# EAGLE design HV Board rev2 (EAGLE 9.0.1)
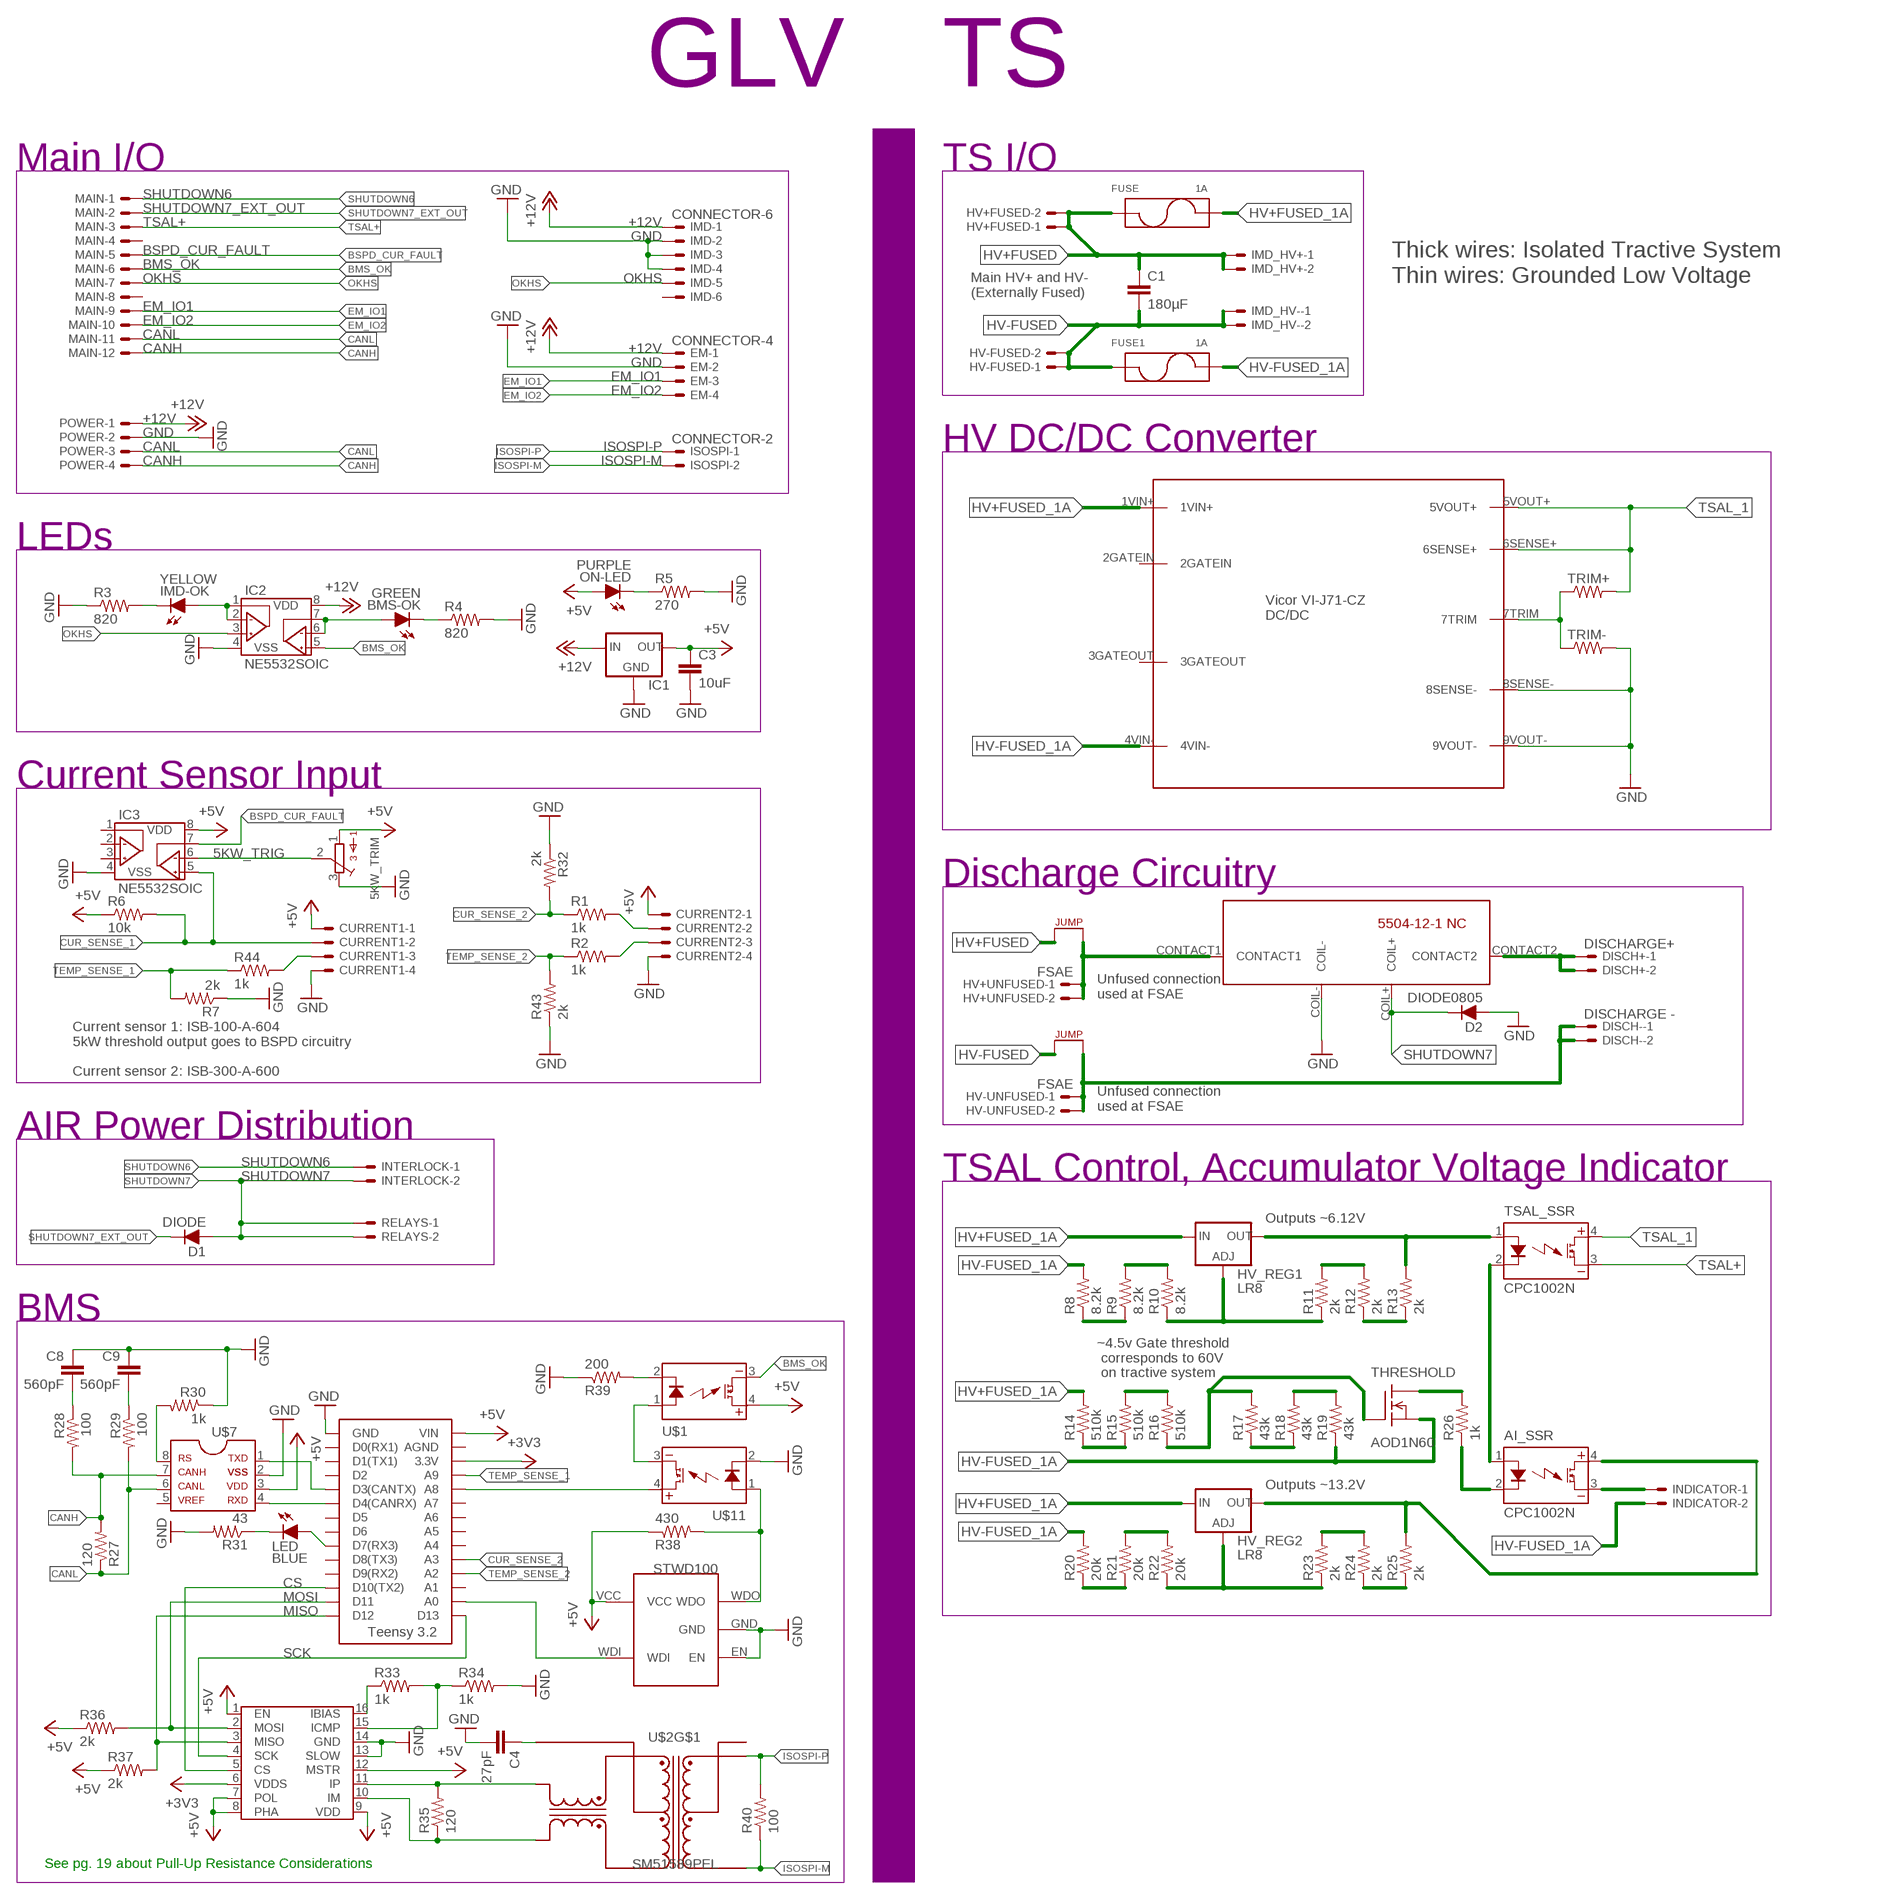
[diagram p0: schematic, sheet 1]

## Parts
5KW_TRIM  TRIMPOT_3296C  [TRIMPOT_3296]
AI_SSR  CPC1002N  [SOP04]
BMS-OK  GREEN  LED-0805  [LED-805]
C1  180µF  CAP  [LLS2V221MELZ]
C3  10uF  CAP0805  [0805]
C4  27pF  CAP0805  [0805]
C8  560pF  CAP0805  [0805]
C9  560pF  CAP0805  [0805]
CURRENT1  CONNECTOR-4  [MINIFIT_5566-4]
CURRENT2  CONNECTOR-4  [MINIFIT_5566-4]
D1  DIODE  DIODEDO-41  [DO-41]
D2  DIODE0805  [0805_D]
DISCH+  DISCHARGE+  MINIFIT_5566-2  [MINIFIT_5566-2]
DISCH-  DISCHARGE -  MINIFIT_5566-2  [MINIFIT_5566-2]
EM  CONNECTOR-4  CONNECTOR-4NANO-FIT-VERTICAL-4  [NANO-FIT_VERTICAL-4]
FUSE  1A  FUSE_5X20MM  [0751.0110]
FUSE1  1A  FUSE_5X20MM  [0751.0110]
HV+FUSED  MINIFIT_5566-2  [MINIFIT_5566-2]
HV+UNFUSED  FSAE  CONNECTOR-2  [MINIFIT_5566-2]
HV-FUSED  MINIFIT_5566-2  [MINIFIT_5566-2]
HV-UNFUSED  FSAE  CONNECTOR-2  [MINIFIT_5566-2]
HV_REG1  LR8  HV_LIN_REG_LR8SMD  [TO-252]
HV_REG2  LR8  HV_LIN_REG_LR8SMD  [TO-252]
IC1  5VREG_L7805_VERT  [TO-220]
IC2  NE5532SOIC  [SOIC-08]
IC3  NE5532SOIC  [SOIC-08]
IMD  CONNECTOR-6  CONNECTOR-6NANO-FIT_VERTICAL-6  [NANO-FIT_VERTICAL-6]
IMD-OK  YELLOW  LED-0805  [LED-805]
IMD_HV+  CONNECTOR-2  [MINIFIT_5566-2]
IMD_HV-  CONNECTOR-2  [MINIFIT_5566-2]
INDICATOR  MINIFIT_5566-2  [MINIFIT_5566-2]
INTERLOCK  MINIFIT_5566-2  [MINIFIT_5566-2]
ISOSPI  CONNECTOR-2  CONNECTOR-2NANO-FIT_VERTICAL-2  [NANO-FIT_VERTICAL-2]
LED  BLUE  LED-0805  [LED-805]
MAIN  CONNECTOR-12  [MINIFIT_5566-12]
ON-LED  PURPLE  LED-0805  [LED-805]
POWER  CONNECTOR-4  [MINIFIT_5566-4]
R1  1k  RESISTOR0805-RES  [0805]
R2  1k  RESISTOR0805-RES  [0805]
R3  820  RESISTOR0805-RES  [0805]
R4  820  RESISTOR0805-RES  [0805]
R5  270  RESISTOR0805-RES  [0805]
R6  10k  RESISTOR0805-RES  [0805]
R7  2k  RESISTOR0805-RES  [0805]
R8  8.2k  RESISTOR0805-RES  [0805]
R9  8.2k  RESISTOR0805-RES  [0805]
R10  8.2k  RESISTOR0805-RES  [0805]
R11  2k  RESISTOR0805-RES  [0805]
R12  2k  RESISTOR0805-RES  [0805]
R13  2k  RESISTOR0805-RES  [0805]
R14  510k  RESISTOR0805-RES  [0805]
R15  510k  RESISTOR0805-RES  [0805]
R16  510k  RESISTOR0805-RES  [0805]
R17  43k  RESISTOR0805-RES  [0805]
R18  43k  RESISTOR0805-RES  [0805]
R19  43k  RESISTOR0805-RES  [0805]
R20  20k  RESISTOR0805-RES  [0805]
R21  20k  RESISTOR0805-RES  [0805]
R22  20k  RESISTOR0805-RES  [0805]
R23  2k  RESISTOR0805-RES  [0805]
R24  2k  RESISTOR0805-RES  [0805]
R25  2k  RESISTOR0805-RES  [0805]
R26  1k  RESISTOR0805-RES  [0805]
R27  120  RESISTOR0805-RES  [0805]
R28  100  RESISTOR0805-RES  [0805]
R29  100  RESISTOR0805-RES  [0805]
R30  1k  RESISTOR0805-RES  [0805]
R31  43  RESISTOR0805-RES  [0805]
R32  2k  RESISTOR0805-RES  [0805]
R33  1k  RESISTOR0805-RES  [0805]
R34  1k  RESISTOR0805-RES  [0805]
R35  120  RESISTOR0805-RES  [0805]
R36  2k  RESISTOR0805-RES  [0805]
R37  2k  RESISTOR0805-RES  [0805]
R38  430  RESISTOR0805-RES  [0805]
R39  200  RESISTOR0805-RES  [0805]
R40  100  RESISTOR0805-RES  [0805]
R43  2k  RESISTOR0805-RES  [0805]
R44  1k  RESISTOR0805-RES  [0805]
RELAYS  MINIFIT_5566-2  [MINIFIT_5566-2]
THRESHOLD  AOD1N60  N-CHANNEL_MOSFETAOD1N60  [TO-252]
TRIM+  RESISTOR0805-RES  [0805]
TRIM-  RESISTOR0805-RES  [0805]
TSAL_SSR  CPC1002N  [SOP04]
U$1  CPC1002N  [SOP04]
U$2  SM51589PEL  [SM51589PEL]
U$3  JUMPER.3  [AXIAL-0.3]
U$4  JUMPER.3  [AXIAL-0.3]
U$5  HV_DCDC_VI-J71-CZ  [HV_DCDC_VI-J71-CZ]
U$7  MCP2551  [SOIC-08]
U$8  LTC6820  [MSOP-16]
U$9  TEENSY_3.2_SIMPLE  [TEENSY_3.2_SIMPLE]
U$10  STWD100  [SOT23-5]
U$11  CPC1002N  [SOP04]
U$12  5504-12-1-NC  [5504-12-1-NC]

## Nets
5KW_TRIG: 5KW_TRIM.2 IC3.6(VINB-)
+3V3: U$8.6(VDDS) U$9.3.3V
+5V: 5KW_TRIM.1 C3.1 CURRENT1.1 CURRENT2.1 IC1.3(OUT) IC3.8(VDD) ON-LED.A R6.1 R36.1 R37.1 R38.1 U$1.4(DC+) U$7.3 U$8.1(EN) U$8.7(POL) U$8.8(PHA) U$8.9(VDD) U$8.12(MSTR) U$9.VIN U$10.VCC
+12V: EM.P$1 IC1.1(IN) IC2.8(VDD) IMD.P$1 POWER.1
BMS_OK: IC2.5(VINB+) MAIN.6 U$1.3(DC-)
BMS_WATCH: U$1.1(CONTROL+) U$11.3(DC-)
BSPD_CUR_FAULT: IC3.7(VOUTB) MAIN.5
CANH: MAIN.12 POWER.4 R27.2 R28.2 U$7.7
CANL: MAIN.11 POWER.3 R27.1 R29.2 U$7.6
CS: U$8.5(CS) U$9.D10(TX2)
CUR_SENSE_1: CURRENT1.2 IC3.5(VINB+) R6.2
CUR_SENSE_2: R1.1 R32.2 U$9.A3
DISCHARGE1: HV+UNFUSED.1 HV+UNFUSED.2 U$3.P$2 U$12.CONTACT1
DISCHARGE2: DISCH+.1 DISCH+.2 U$12.CONTACT2
DISCHARGE3: DISCH-.1 DISCH-.2 HV-UNFUSED.1 HV-UNFUSED.2 U$4.P$2
EM_IO1: EM.P$3 MAIN.9
EM_IO2: EM.P$4 MAIN.10
GND: 5KW_TRIM.3 C3.2 C4.2 C8.1 C9.1 CURRENT1.4 CURRENT2.4 D2.A EM.P$2 IC1.2(GND) IC2.4(VSS) IC3.4(VSS) IMD.P$2 IMD.P$3 IMD.P$4 POWER.2 R3.1 R4.2 R5.2 R7.1 R30.1 R31.2 R32.1 R34.2 R39.1 R43.1 TRIM-.2 U$5.8SENSE- U$5.9VOUT- U$7.2 U$8.13(SLOW) U$8.14(GND) U$9.GND U$10.EN U$10.GND U$11.2(CONTROL-) U$12.COIL-
HV+FUSED: C1.P$1 FUSE.L1(P1) FUSE.L2(P1) HV+FUSED.1 HV+FUSED.2 IMD_HV+.1 IMD_HV+.2 U$3.P$1
HV+FUSED_1A: FUSE.R1(P2) FUSE.R2(P2) HV_REG1.1(IN) HV_REG2.1(IN) R14.2 U$5.1VIN+
HV-FUSED: C1.P$2 FUSE1.L1(P1) FUSE1.L2(P1) HV-FUSED.1 HV-FUSED.2 IMD_HV-.1 IMD_HV-.2 U$4.P$1
HV-FUSED_1A: FUSE1.R1(P2) FUSE1.R2(P2) INDICATOR.2 R8.2 R19.1 R20.2 THRESHOLD.3(S) U$5.4VIN-
ISOSPI-M: ISOSPI.P$2 R40.1 U$2.3(MX-)
ISOSPI-P: ISOSPI.P$1 R40.2 U$2.2(MX+)
MISO: R37.2 U$8.3(MISO) U$9.D12
MOSI: R36.2 U$8.2(MOSI) U$9.D11
N$1: AI_SSR.4(DC+) HV_REG2.2(TAB)(OUT) R25.2
N$2: HV_REG1.2(TAB)(OUT) R13.2 TSAL_SSR.1(CONTROL+)
N$3: ON-LED.C R5.1
N$4: R39.2 U$1.2(CONTROL-)
N$5: AI_SSR.2(CONTROL-) R26.1
N$6: AI_SSR.1(CONTROL+) TSAL_SSR.2(CONTROL-)
N$7: AI_SSR.3(DC-) INDICATOR.1
N$8: R8.1 R9.1
N$9: R26.2 THRESHOLD.2(TAB)(D)
N$10: R14.1 R15.1
N$11: R15.2 R16.2
N$12: R17.1 R18.1
N$13: R18.2 R19.2
N$14: R9.2 R10.2
N$15: HV_REG2.3(ADJ) R22.1 R23.1
N$16: R11.2 R12.2
N$17: R12.1 R13.1
N$18: HV_REG1.3(ADJ) R10.1 R11.1
N$19: R23.2 R24.2
N$20: R24.1 R25.1
N$21: R21.2 R22.2
N$22: R16.1 R17.2 THRESHOLD.1(G)
N$23: R20.1 R21.1
N$25: U$7.1 U$9.D3(CANTX)
N$26: R30.2 U$7.8
N$27: C8.2 R28.1
N$28: C9.2 R29.1
N$29: LED.C R31.1
N$30: CURRENT2.2 R1.2
N$31: R33.1 U$8.16(IBIAS)
N$32: R33.2 R34.1 U$8.15(ICMP)
N$33: R35.1 U$2.22(TD-) U$8.10(IM)
N$34: R35.2 U$2.23(TD+) U$8.11(IP)
N$35: C4.1 U$2.24(TCT)
N$36: U$7.4 U$9.D4(CANRX)
N$37: LED.A U$9.D7(RX3)
N$38: R38.2 U$10.WDO U$11.1(CONTROL+)
N$40: U$9.A8 U$11.4(DC+)
N$42: IC2.1(VOUTA) IC2.2(VINA-) IMD-OK.A
N$43: BMS-OK.A IC2.6(VINB-) IC2.7(VOUTB)
N$44: BMS-OK.C R4.1
N$45: IMD-OK.C R3.2
N$50: U$9.A0 U$10.WDI
N$53: CURRENT1.3 R44.2
N$54: CURRENT2.3 R2.2
OKHS: IC2.3(VINA+) IMD.P$5 MAIN.7
SCK: U$8.4(SCK) U$9.D13
SHUTDOWN6: INTERLOCK.1 MAIN.1
SHUTDOWN7: D1.A D2.C INTERLOCK.2 RELAYS.1 RELAYS.2 U$12.COIL+
SHUTDOWN7_EXT_OUT: D1.C MAIN.2
TEMP_SENSE_1: R7.2 R44.1 U$9.A9
TEMP_SENSE_2: R2.1 R43.2 U$9.A2
TRIM: TRIM+.1 TRIM-.1 U$5.7TRIM
TSAL+: MAIN.3 TSAL_SSR.3(DC-)
TSAL_1: TRIM+.2 TSAL_SSR.4(DC+) U$5.5VOUT+ U$5.6SENSE+
Unconnected: IC3.1(VOUTA) IC3.2(VINA-) IC3.3(VINA+) IMD.P$6 MAIN.4 MAIN.8 U$2.1(MCT) U$2.4(MCT) U$2.5(MX+) U$2.6(MX-) U$2.7(MCT) U$2.8(MX+) U$2.9(MX-) U$2.10(MCT) U$2.11(MX+) U$2.12(MX-) U$2.13(TD-) U$2.14(TD+) U$2.15(TCT) U$2.16(TD-) U$2.17(TD+) U$2.18(TCT) U$2.19(TD-) U$2.20(TD+) U$2.21(TCT) U$5.2GATEIN U$5.3GATEOUT U$7.5 U$9.A1 U$9.A4 U$9.A5 U$9.A6 U$9.A7 U$9.AGND U$9.D0(RX1) U$9.D1(TX1) U$9.D2 U$9.D5 U$9.D6 U$9.D8(TX3) U$9.D9(RX2)

## Notes on the sheet
- GLV
- TS
- Main I/O | TS I/O
- Thick wires: Isolated Tractive System
  Thin wires: Grounded Low Voltage
- Main HV+ and HV-
  (Externally Fused)
- HV DC/DC Converter
- LEDs
- Current Sensor Input
- Discharge Circuitry
- Unfused connection
  used at FSAE
- Current sensor 1: ISB-100-A-604
  5kW threshold output goes to BSPD circuitry
  
  Current sensor 2: ISB-300-A-600
- Unfused connection
  used at FSAE
- AIR Power Distribution
- TSAL Control, Accumulator Voltage Indicator
- Outputs ~6.12V
- BMS
- ~4.5v Gate threshold
   corresponds to 60V
   on tractive system
- Outputs ~13.2V
- See pg. 19 about Pull-Up Resistance Considerations

## Library data of the parts
5KW_TRIM = HyTechDevices:TRIMPOT_3296: 3296 Series 3/8" Square Trimmer Source <https://github.com/chiengineer/Eagle-Libraries/blob/master/Potentiometers/bourns.lbr>
AI_SSR TSAL_SSR U$1 U$11 = HyTechDevices:CPC1002N: IXYS Solid State Relay .7A
BMS-OK IMD-OK LED ON-LED = HyTechDevices:LED: Light Emitting Diode (LED) Source: Dangerous Prototypes Eagle Library <https://github.com/DangerousPrototypes/Eagle_Part_Library>
C1 C3 C4 C8 C9 = HyTechDevices:CAP: Capacitor Standard 0603 ceramic capacitor, and 0.1" leaded capacitor.
CURRENT1 CURRENT2 POWER = HyTechDevices:CONNECTOR-4: Mini-Fit Junior connector 4 pole Source: http://www.molex.com; OC_FARNELL: unknown; OC_NEWARK: unknown
D1 D2 = HyTechDevices:DIODE: DIODE general purpose rectifier
DISCH+ DISCH- HV+FUSED HV-FUSED INDICATOR INTERLOCK RELAYS = HyTechDevices:MINIFIT_5566-2: Mini-Fit Junior connector 2 pole Source: http://www.molex.com; OC_FARNELL: 1822072; OC_NEWARK: unknown
EM = HyTechDevices:CONNECTOR-4: Mini-Fit Junior connector 4 pole Source: http://www.molex.com
FUSE FUSE1 = HyTechDevices:FUSE: Fuse/Fuseclips Keystone Electronics 3568 Fuse Mouser Part <http://www.mouser.com/ProductDetail/Keystone-Electronics/3568> Datasheet <http://www.mouser.com/ds/2/215/568-742601.pdf> Bussman/Eaton Midget Fuse Clip 1A3400 <http://www.mouser.com/ProductDetail/Bussmann-Eaton/BK-1A3400-09-R/?qs=sGAEpiMZZMuG%252bgnN5hGYGzzlAelq2OxnKqVSMVjq8I4%3d> Schurter 0751.0110 Brass Fuse Clip Datasheet <http://www.mouser.com/ds/2/358/typ_OG__Clip__5x20-2553.pdf>
HV+UNFUSED HV-UNFUSED IMD_HV+ IMD_HV- = HyTechDevices:CONNECTOR-2: Mini-Fit Junior connector 2 pole Source: http://www.molex.com; OC_FARNELL: 1822072; OC_NEWARK: unknown
HV_REG1 HV_REG2 = HyTechDevices:HV_LIN_REG_LR8
IC1 = HyTechDevices:5VREG_L7805: Voltage Regulator Switching 5v regulator Datasheet <http://power.murata.com/data/power/oki-78sr.pdf> Standard 7805 5V regulator. IGO (Input Ground Output). Spark Fun Electronics SKU : COM-00107 Datasheet <http://www.mouser.com/ds/2/308/MC7800-D-94905.pdf>
IC2 IC3 = HyTechDevices:NE5532: TI NE5532 Dual Channel Op Amp
IMD = HyTechDevices:CONNECTOR-6: Mini-Fit Junior connector 6 pole Source: http://www.molex.com
ISOSPI = HyTechDevices:CONNECTOR-2: Mini-Fit Junior connector 2 pole Source: http://www.molex.com
MAIN = HyTechDevices:CONNECTOR-12: Mini-Fit Junior connector 12 pole Source: http://www.molex.com; OC_FARNELL: unknown; OC_NEWARK: unknown
R1-R40 R43 R44 TRIM+ TRIM- = HyTechDevices:RESISTOR: Resistor Basic schematic elements and footprints for 0603, 1206, and PTH resistors.
THRESHOLD = HyTechDevices:N-CHANNEL_MOSFET: Generic N-Channel MOSFET
U$2 = HyTechDevices:SM51589PEL: Bourns High Isolation LAN Transformer Module 5000 VAC Isolation Turns Ratio: 1CT:1CT Inductance: 350 uH Leakage Inductance: 0.5 uH Datasheet <http://www.mouser.com/ds/2/54/m51589pel-778121.pdf>
U$3 U$4 = HyTechDevices:JUMPER: Jumper for changing operation of a device
U$5 = HyTechDevices:HV_DCDC_VI-J71-CZ: Vicor-Corporation VI-J71-CZ Product Page <https://www.digikey.com/product-detail/en/vicor-corporation/VI-J71-CZ/1102-1486-ND/2996194> Datasheet <http://cdn.vicorpower.com/documents/datasheets/ds_vi-j00.pdf>
U$7 = HyTechDevices:MCP2551: MCP2551 High-Speed CAN Transceiver Product Webpage <https://www.microchip.com/wwwproducts/en/MCP2551> Datasheet <http://ww1.microchip.com/downloads/en/DeviceDoc/21667f.pdf> This device is outdated It is replaced by MCP2561. Comparison Page <https://www.microchip.com/wwwproducts/ProductCompare/MCP2551/MCP2561> Product Webpage <https://www.microchip.com/wwwproducts/en/MCP2561> Datasheet <http://ww1.microchip.com/downloads/en/DeviceDoc/20005167C.pdf>
U$8 = HyTechDevices:LTC6820
U$9 = HyTechDevices:TEENSY_3.2_SIMPLE: Simple version of the Teensy 3.2 board that only uses the 2 main rows of pins, not the inner pins or the pins opposite the usb port.
U$10 = HyTechDevices:STWD100: STWD100 Watchdog timer
U$12 = HyTechDevices:5504-12-1-NC: Relay 5504-12-1 Normally Closed(Form B)

## Board
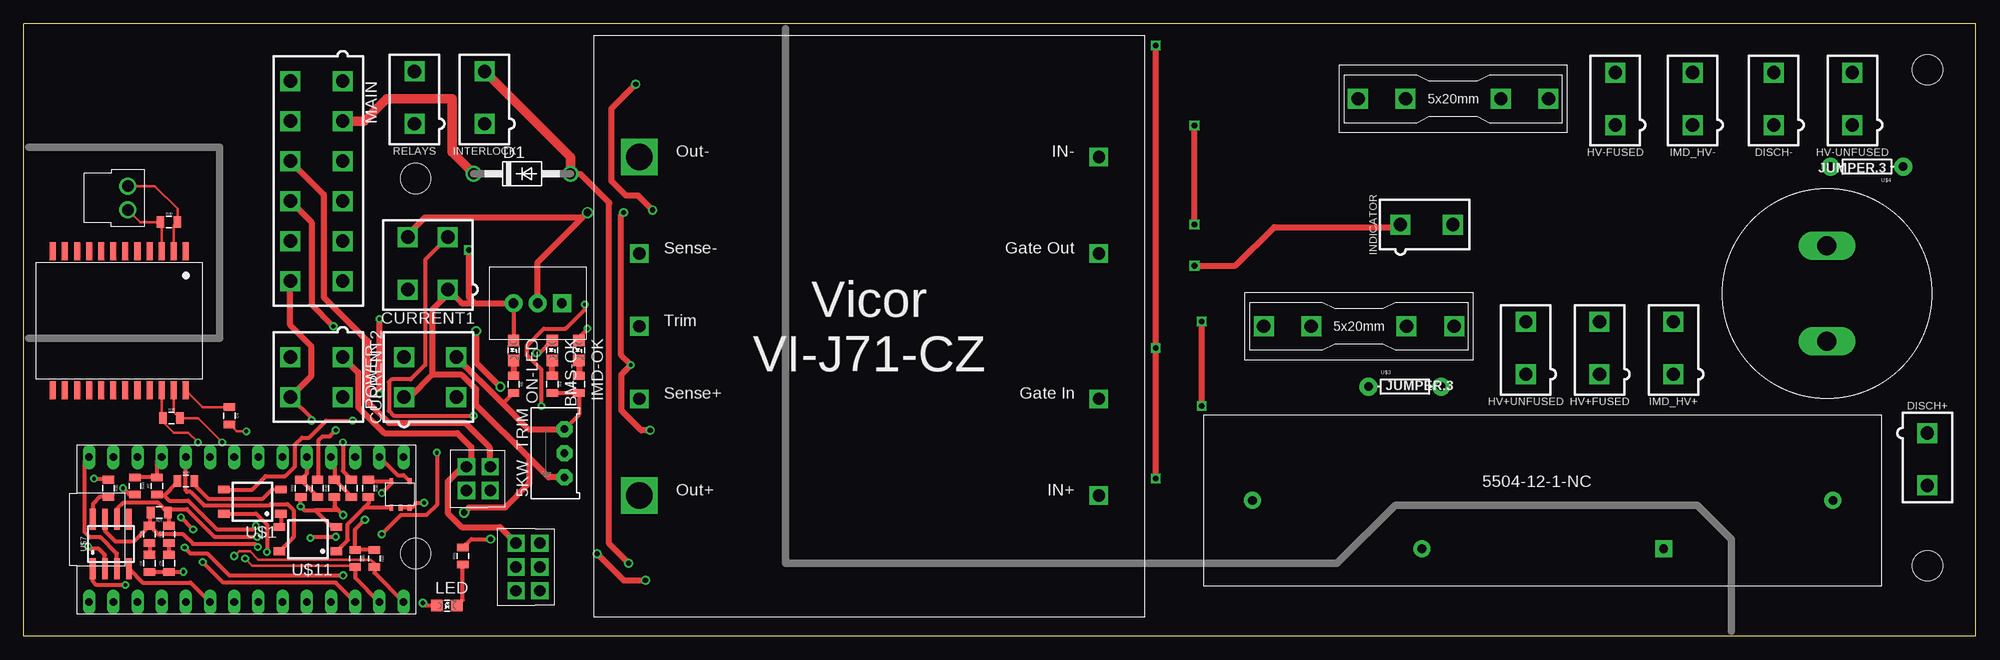
[diagram p1: board, top side]
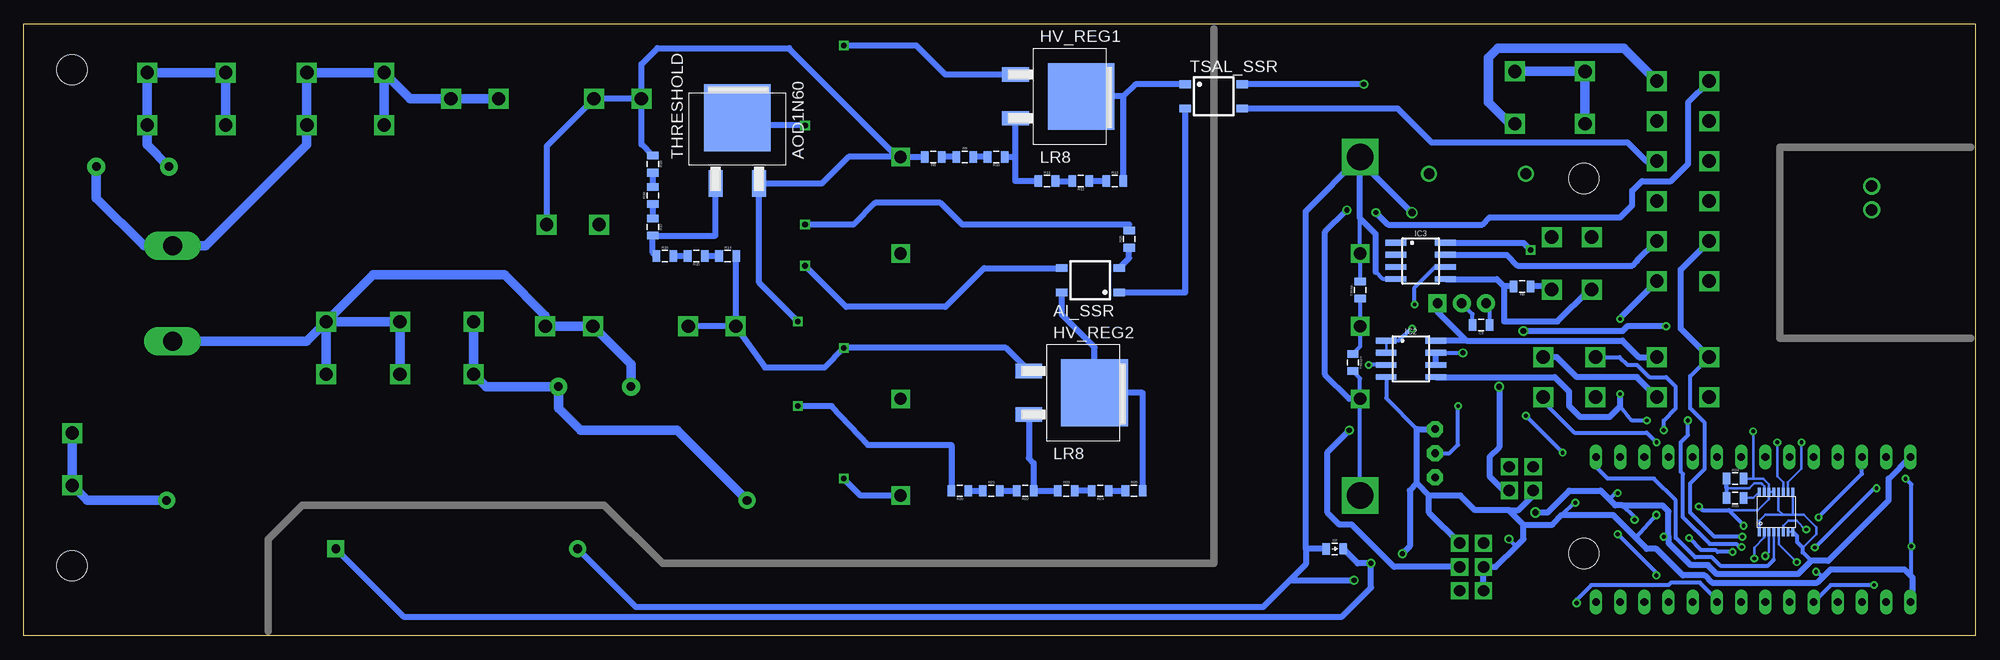
[diagram p2: board, bottom side, seen from below]

Size 204.98 x 64.26 mm. Coordinates in mm from the lower left corner, seen from the top.
Outline: 0,0 204.98,0 204.98,64.26 0,64.26 0,0
Copper layers (1*16): Top 0.035mm / dielectric 1.5mm / Bottom 0.035mm
Design rules "default *": minimum track width 6mil, minimum drill 15mil, track to track 6mil, track to pad 6mil, pad to pad 6mil, via to via 6mil, smd to smd 6mil, copper to edge 6mil, drill to drill 15mil, minimum pad ring 10mil, minimum via ring 8mil, stop-mask expansion 4mil, vias tented up to drill 0mil, thermal gap 10mil
Holes 3.2 mm at 41.15,48.01 41.15,8.64 199.9,7.37 199.9,59.44

### Footprints (pad centres in the part's own frame; a part is rotated, then mirrored left to right if it is on the bottom)
TRIMPOT_3296 = drill 0.813 pad 1.676 octagon: 1 2.54,1.27; 2 0,1.27; 3 -2.54,1.27
SOP04 = smd 0.8 x 1.2: 1 -1.27,-3; 2 1.27,-3; 3 1.27,3; 4 -1.27,3
LED-805 = smd 1.2 x 1.2: A 0,-1.05; C 0,1.05
LLS2V221MELZ = drill 2 long: P$1 -5,0; P$2 5,0
0805 = smd 0.8 x 1.2: 1 -0.9,0; 2 0.9,0
MINIFIT_5566-4 = drill 1.4 square: 1 2.1,-2.75; 2 -2.1,-2.75; 3 2.1,2.75; 4 -2.1,2.75
DO-41 = drill 1.118: A 5.08,0; C -5.08,0
0805_D = smd 0.8 x 1.2: A -0.9,0; C 0.9,0
MINIFIT_5566-2 = drill 1.4 square: 1 0,-2.75; 2 0,2.75
NANO-FIT_VERTICAL-4 = drill 1.2 square: P$1 -1.25,0; P$2 1.25,0; P$3 -1.25,2.5; P$4 1.25,2.5
0751.0110 = drill 1.4 square: L1 -10,0; L2 -5,0; R1 5,0; R2 10,0
TO-252 = smd 1.499 x 2.794: 1 -2.286,0; 3 2.286,0 | smd 7.01 x 7.01: 2(TAB) 0,6.909
TO-220 = drill 1 pad 1.88 square: 1 -2.54,0 | drill 1 pad 1.88: 2 0,0; 3 2.54,0
SOIC-08 = smd 0.6 x 2.2: 1 -1.905,-2.6; 2 -0.635,-2.6; 3 0.635,-2.6; 4 1.905,-2.6; 5 1.905,2.6; 6 0.635,2.6; 7 -0.635,2.6; 8 -1.905,2.6
NANO-FIT_VERTICAL-6 = drill 1.2 square: P$1 -2.5,0; P$2 0,0; P$3 2.5,0; P$4 -2.5,2.5; P$5 0,2.5; P$6 2.5,2.5
NANO-FIT_VERTICAL-2 = drill 1.2: P$1 -1.25,0; P$2 1.25,0
MINIFIT_5566-12 = drill 1.4 square: 1 10.5,-2.75; 2 6.3,-2.75; 3 2.1,-2.75; 4 -2.1,-2.75; 5 -6.3,-2.75; 6 -10.5,-2.75; 7 10.5,2.75; 8 6.3,2.75; 9 2.1,2.75; 10 -2.1,2.75; 11 -6.3,2.75; 12 -10.5,2.75
SM51589PEL = smd 0.635 x 1.905: 1 0,0; 2 1.27,0; 3 2.54,0; 4 3.81,0; 5 5.08,0; 6 6.35,0; 7 7.62,0; 8 8.89,0; 9 10.16,0; 10 11.43,0; 11 12.7,0; 12 13.97,0; 13 13.97,14.605; 14 12.7,14.605; 15 11.43,14.605; 16 10.16,14.605; 17 8.89,14.605; 18 7.62,14.605; 19 6.35,14.605; 20 5.08,14.605; 21 3.81,14.605; 22 2.54,14.605; 23 1.27,14.605; 24 0,14.605
AXIAL-0.3 = drill 0.9 pad 1.88: P$1 -3.81,0; P$2 3.81,0
HV_DCDC_VI-J71-CZ = drill 1.3 square: 1VIN+ 5.08,-12.7; 2GATEIN 5.08,-22.86; 3GATEOUT 5.08,-38.1; 4VIN- 5.08,-48.26; 6SENSE+ 53.34,-22.86; 7TRIM 53.34,-30.48; 8SENSE- 53.34,-38.1 | drill 2.8 square: 5VOUT+ 53.34,-12.7; 9VOUT- 53.34,-48.26
MSOP-16 = smd 0.305 x 0.889: 1 -0.1,-0.5; 2 0.4,-0.5; 3 0.9,-0.5; 4 1.4,-0.5; 5 1.9,-0.5; 6 2.4,-0.5; 7 2.9,-0.5; 8 3.4,-0.5; 9 3.4,3.7; 10 2.9,3.7; 11 2.4,3.7; 12 1.9,3.7; 13 1.4,3.7; 14 0.9,3.7; 15 0.4,3.7; 16 -0.1,3.7
TEENSY_3.2_SIMPLE = drill 0.8 long: 3.3V 16.51,29.21; A0 16.51,3.81; A1 16.51,6.35; A2 16.51,8.89; A3 16.51,11.43; A4 16.51,13.97; A5 16.51,16.51; A6 16.51,19.05; A7 16.51,21.59; A8 16.51,24.13; A9 16.51,26.67; AGND 16.51,31.75; D0(RX1) 1.27,31.75; D1(TX1) 1.27,29.21; D2 1.27,26.67; D3(CANTX) 1.27,24.13; D4(CANRX) 1.27,21.59; D5 1.27,19.05; D6 1.27,16.51; D7(RX3) 1.27,13.97; D8(TX3) 1.27,11.43; D9(RX2) 1.27,8.89; D10(TX2) 1.27,6.35; D11 1.27,3.81; D12 1.27,1.27; D13 16.51,1.27; GND 1.27,34.29; VIN 16.51,34.29
SOT23-5 = smd 0.61 x 0.406: EN -2.794,0; GND -2.794,0.94; VCC 0,1.905; WDI 0,0; WDO -2.794,1.905
5504-12-1-NC = drill 0.914 pad 1.778 square: COIL+ 48.26,-14.097 | drill 0.914 pad 1.778: COIL- 22.86,-14.097; CONTACT1 5.08,-9.017; CONTACT2 66.04,-9.017

### Placement (x,y rotation side)
5KW_TRIM  55.5,19.18 270 top
AI_SSR  92.96,37.34 90 bottom
BMS-OK  55.5,29.97 180 top
C1  189.36,35.94 90 top
C3  51.94,32.64 180 bottom
C4  21.59,23.11 270 top
C8  13.21,7.62 90 top
C9  15.24,7.62 90 top
CURRENT1  42.42,39.12 0 top
CURRENT2  42.67,27.18 270 top
D1  52.32,48.51 0 top
D2  67.31,9.14 0 bottom
DISCH+  199.9,18.54 180 top
DISCH-  183.77,56.39 0 top
EM  46.48,16.51 270 top
FUSE  140.21,32.51 180 top
FUSE1  150.11,56.39 180 top
HV+FUSED  165.48,30.23 0 top
HV+UNFUSED  157.73,30.23 0 top
HV-FUSED  167.13,56.39 0 top
HV-UNFUSED  192.02,56.39 0 top
HV_REG1  100.84,56.64 270 bottom
HV_REG2  99.44,25.53 270 bottom
IC1  53.98,34.92 180 top
IC2  59.31,29.08 270 bottom
IC3  58.29,39.37 270 bottom
IMD  51.69,7.24 270 top
IMD-OK  58.29,29.97 180 top
IMD_HV+  173.23,30.23 0 top
IMD_HV-  175.26,56.39 0 top
INDICATOR  147.32,43.18 270 top
INTERLOCK  48.39,56.52 0 top
ISOSPI  10.92,45.97 270 top
LED  44.45,3.17 270 top
MAIN  30.73,47.75 90 top
ON-LED  51.44,29.97 180 top
POWER  30.73,27.18 90 top
R1  30.86,15.49 90 top
R2  34.42,15.49 90 top
R3  58.29,26.42 90 top
R4  55.5,26.42 270 top
R5  51.44,26.42 270 top
R6  47.62,36.7 180 bottom
R7  13.97,15.75 90 top
R8  109.47,50.29 180 bottom
R9  106.17,50.29 0 bottom
R10  102.87,50.29 180 bottom
R11  97.54,47.75 0 bottom
R12  93.98,47.75 180 bottom
R13  90.42,47.75 0 bottom
R14  131.06,39.88 0 bottom
R15  134.37,39.88 180 bottom
R16  137.67,39.88 0 bottom
R17  138.94,42.93 270 bottom
R18  138.94,46.23 90 bottom
R19  138.94,49.53 270 bottom
R20  106.68,15.24 180 bottom
R21  103.38,15.24 0 bottom
R22  99.82,15.24 180 bottom
R23  95.5,15.24 0 bottom
R24  91.95,15.24 180 bottom
R25  88.39,15.24 0 bottom
R26  88.9,41.66 90 bottom
R27  14.22,12.95 180 top
R28  13.21,10.67 90 top
R29  15.24,10.67 90 top
R30  8.89,15.49 270 top
R31  46.1,8.38 90 top
R32  29.08,15.49 90 top
R33  25.27,14.48 180 bottom
R34  25.27,16.51 0 bottom
R35  15.49,22.86 0 top
R36  34.8,8.13 270 top
R37  36.83,8.13 270 top
R38  36.2,15.49 270 top
R39  17.02,16.26 0 top
R40  15.24,43.43 0 top
R43  32.64,15.49 90 top
R44  11.68,15.75 270 top
RELAYS  41.02,56.52 0 top
THRESHOLD  130.05,47.5 0 bottom
TRIM+  65.41,28.7 270 bottom
TRIM-  64.64,36.32 90 bottom
TSAL_SSR  80.01,56.64 270 bottom
U$1  24,14.1 90 top
U$2  17.02,40.39 180 top
U$3  145.03,26.16 0 top
U$4  193.55,49.28 180 top
U$5  117.98,2.03 180 top
U$7  9.14,9.65 0 top
U$8  22.61,11.43 0 bottom
U$9  41.15,2.29 90 top
U$10  40.51,16.26 90 top
U$11  29.84,10.16 90 top
U$12  123.95,23.24 0 top

### Tracks (layer width: path | path; a pad name or v marks a point on that pad's centre or on a via)
5KW_TRIG  (via drill 0.4)
  Top 0.406: v54.36,24.13 54.36,27.94 52.83,29.46 52.83,30.48 54.61,32.26 56.9,32.26 58.93,34.29 v58.93,34.8
  Bottom 0.406: 5KW_TRIM.2 55.24,19.18 54.36,20.07 v54.36,24.13 | IC3.6 56.75,38.73 58.93,36.55 v58.93,34.8
+3V3  (via drill 0.4)
  Top 0.406: v17.79,11.16 v16.51,12.45
  Bottom 0.254: U$8.6 20.21,11.54 19.68,12.06 18.8,12.06 17.9,11.16 v17.79,11.16
  Bottom 0.406: U$9.3.3V 11.94,17.02 v16.51,12.45
+5V  (via drill 0.4, 0.45, 0.6, 0.65)
  Top 0.406: IC1.3 ON-LED.A | R37.1 R36.1 34.8,11.18 v35.81,12.19 | R38.1 35.95,16.26 U$10.VCC 38.61,16 v37.59,14.99 | U$7.3 9.78,8.64 8.06,10.36 6.92,10.36 6.35,10.92 6.35,18.29 U$9.VIN | U$1.4 24.38,12.83 25.53,11.68 v25.53,8.81 | v30.1,10.29 30.23,10.41 v32.77,10.41
  Top 0.61: v46.74,40.51 46.74,35.56 47.37,34.92 | 47.37,34.92 IC1.3 | 42.9,27.41 42.93,27.43 42.93,34.29 44.52,35.88 CURRENT1.1 45.96,34.92 47.37,34.92 | 42.9,27.41 40.57,25.08 CURRENT2.1 | 42.9,27.41 46,27.41 47.52,25.88 47.52,24.24 53.09,18.68 | 53.09,18.68 53.09,16 50.55,13.46 46.76,13.46 v46.25,12.95 | 5KW_TRIM.1 55.13,16.64 53.09,18.68
  Bottom 0.254: U$8.1 22.71,12.09 22.1,12.7 20.19,12.7 | 20.19,12.7 19.25,12.7 | U$8.12 20.71,13.22 20.19,12.7 | U$8.9 19.21,12.74 19.25,12.7 | 19.25,12.7 18.03,12.7 16.76,11.43 16.76,10.67 18.16,9.27 | U$8.8 U$8.7
  Bottom 0.406: C3.1 51.04,34.53 IC1.3 | U$8.8 18.74,10.47 18.74,9.85 18.16,9.27 18.16,8.76 17.27,7.87 | v35.81,12.19 35.81,12.45 37.08,13.72 | v37.59,14.99 37.85,14.99 38.48,14.35 | v30.1,10.29 28.83,9.02 27.3,9.02 27.1,8.81 v25.53,8.81 | v32.77,10.41 32.26,10.41
  Bottom 0.61: IC3.8 47.5,41.27 v46.74,40.51 | CURRENT1.1 44.85,36.7 R6.1 | v46.25,12.95 44.96,12.95 42.67,15.24 39.37,15.24 38.48,14.35 37.85,13.72 37.08,13.72 32.89,13.72 32.26,13.08 32.26,10.41 32.26,9.78 29.91,7.43 28.13,7.43 27.18,6.48 18.67,6.48 17.27,7.87 15.49,7.87 9.14,14.22 9.14,16.51 U$9.VIN
+12V
  Top 0.61: POWER.1 35.13,27.63 35.13,24.02 37.86,21.29 45.52,21.29 46.99,19.81 46.99,18.27 EM.P$1 46.1,17.76 44.52,16.18 44.52,12.88 45.97,11.43 50,11.43 IMD.P$1
  Bottom 0.61: 53.48,30.99 IC2.8 | 53.48,30.99 37.08,30.99 35.37,29.28 POWER.1 | IC1.1 56.52,34.03 53.48,30.99
BMS_OK  (via drill 0.4)
  Top 0.406: v34.54,22.61 31.75,22.61 29.97,20.83 29.21,20.83 28.45,20.07 28.45,17.78 27.43,16.76 25.4,16.76 24,15.37 U$1.3
  Top 0.61: v37.34,33.27 v37.34,25.4
  Bottom 0.406: v34.54,22.61 36.09,22.61 37.34,24.11
  Bottom 0.61: IC2.5 44.2,27.18 42.67,25.65 42.67,24.13 41.52,22.98 38.47,22.98 37.34,24.11 v37.34,25.4 | MAIN.6 37.34,33.4 v37.34,33.27
BMS_WATCH
  Top 0.406: U$1.1 27,11.59 U$11.3
BSPD_CUR_FAULT
  Bottom 0.61: IC3.7 49.26,40.01 48.11,38.86 36.07,38.86 35.56,39.37 35.56,39.38 MAIN.5
CANH  (via drill 0.4, 0.45)
  Top 0.406: v30.23,22.61 30.23,22.84 POWER.4 | U$7.7 8.51,11.05 9.65,9.91 11.55,9.91 R28.2 | R27.2 13.21,12.84 R28.2 | R28.2 14.11,10.67 16.76,10.67 17.78,9.65 24.26,9.65 v24.57,9.34
  Top 0.61: POWER.4 30.23,27.32 30.23,30.35 27.98,32.59 MAIN.12
  Bottom 0.406: v30.23,22.61 30.23,21.08 30.99,20.32 30.99,17.27 30.73,17.02 30.73,12.45 27.94,9.65 25.15,9.65 24.83,9.34 v24.57,9.34
CANL  (via drill 0.4)
  Top 0.406: U$7.6 9.78,13.34 10.41,13.97 14.11,13.97 R27.1 | R27.1 15.24,12.84 R29.2 | R27.1 15.47,13.3 17.11,13.3 20,10.41 v24.51,10.41
  Bottom 0.406: 27.98,29.25 29.97,27.27 29.97,23.88 28.45,22.35 28.45,17.53 29.97,16 29.97,12.95 27.43,10.41 v24.51,10.41
  Bottom 0.61: POWER.3 27.98,29.25 30.99,32.26 30.99,38.45 MAIN.11
CS  (via drill 0.4)
  Top 0.406: U$9.D10(TX2) 32.77,5.59 20.95,5.59 v18.8,7.75
  Bottom 0.254: U$8.5 20.69,10.91 20.69,9.64 v18.8,7.75
CUR_SENSE_1
  Bottom 0.61: 49.53,36.7 49.53,33.02 43.92,33.02 40.57,36.37 CURRENT1.2 | IC3.5 50.29,37.47 49.53,36.7 | R6.2 49.53,36.7
CUR_SENSE_2
  Top 0.406: R1.1 29.08,16.37 R32.2 29.72,17.03 U$9.A3
DISCHARGE1
  Bottom 1.016: HV+UNFUSED.2 HV+UNFUSED.1 156.42,26.16 U$3.P$2 148.79,25.72 148.79,23.88 146.5,21.59 136.4,21.59 U$12.CONTACT1
DISCHARGE2
  Bottom 1.016: DISCH+.1 DISCH+.2 198.33,14.22 U$12.CONTACT2
DISCHARGE3
  Bottom 1.016: DISCH-.1 DISCH-.2 HV-UNFUSED.2 HV-UNFUSED.1 192.02,51.56 U$4.P$2
EM_IO1
  Top 0.61: MAIN.9 31.5,46.34 31.5,35.56 36.07,30.99 36.07,24.61 38.32,22.35 46.35,22.35 48.9,19.81 48.9,17.85 EM.P$3
EM_IO2  (via drill 0.45, 0.6)
  Top 0.61: MAIN.10 28.01,45.65 30.23,43.43 30.23,34.8 v32.51,32.51 | v47.5,32 47.5,28.7 v50.04,26.16
  Bottom 0.61: EM.P$4 49.55,15.26 51.05,16.76 51.05,18.8 50.04,19.81 v50.04,26.16 | v32.51,32.51 36.58,32.51 37.08,32 v47.5,32
GND  (via drill 0.4, 0.45, 0.5, 0.55, 0.75)
  Top 0.254: v23.37,21.47 22.33,21.47 C4.2
  Top 0.406: R4.2 R3.1 58.29,23.24 5KW_TRIM.3 | R5.2 50.47,24.55 50.15,24.55 | C8.1 C9.1 v16.75,6.72 v16.76,6.73 | U$10.GND U$10.EN 40.77,13.46 41.27,13.97 v42.04,13.97 | 30.61,13.21 29.46,13.21 v29.08,13.59 R32.1 | 32.46,11.62 U$11.2 32.38,11.43 30.61,13.21 | R31.2 46.98,10.16 v49.02,10.16 | 33.02,13.21 30.61,13.21 | 33.02,13.21 v33.53,12.7 | U$7.2 8.51,8.51 7.87,9.14 7.01,9.14 v6.75,9.4 | v7.37,16.51 9.03,16.51 R30.1 | R7.1 14.09,14.73 14.73,14.73 | 14.73,14.73 15.27,14.2 17.24,14.2 20.26,11.18 24,11.18 v24.38,11.56 | R39.1 16.12,16.12 14.73,14.73 | R43.1 32.64,13.59 33.02,13.21
  Top 0.61: IC1.2 53.98,39.24 58.67,43.94 | CURRENT2.4 50.15,24.55 52.98,21.72 5KW_TRIM.3 | v60.2,8.64 62.99,5.84 v65.28,5.84 | CURRENT1.4 40.32,42.12 42.14,43.94 58.67,43.94 | 58.67,43.94 v59.18,44.45
  Bottom 0.254: U$8.14 U$8.13 | U$8.14 21.71,14.36 22.86,13.21 25.91,13.21 | U$8.14 21.72,15.15 21.72,15.93 22.3,16.51 23.37,16.51 | 23.37,16.51 R34.2 | 23.37,16.51 v23.37,21.47
  Bottom 0.406: TRIM-.2 U$5.8SENSE- 64.64,43.83 | IC3.4 62.23,37.47 62.99,38.23 | IC2.4 61.91,24.95 58.67,21.72 | C3.2 52.84,33.79 IC1.2 | 6.66,6.15 6.75,6.25 v6.75,9.4 6.75,15.9 v7.37,16.51 | v49.02,10.16 48.39,9.53 48.13,9.53 | v33.53,12.7 35.69,10.29 | v24.38,11.56 24.38,11.68 25.91,13.21 28.7,13.21 v29.08,13.59 | v16.76,6.73 16.64,6.73 16.07,6.16 | v42.04,13.97 42.16,13.97 43.43,12.7
  Bottom 0.61: 5KW_TRIM.3 58.67,21.72 58.67,16 | 57.4,14.73 58.67,16 | U$5.9VOUT- 64.77,50.29 | U$5.9VOUT- 70.36,44.58 70.36,9.14 | 70.36,9.14 70.36,7.5 72.01,5.84 | D2.A 70.36,9.14 | U$5.9VOUT- 64.64,43.83 62.99,42.18 62.99,38.23 | 58.67,16 59.44,15.24 59.44,9.4 v60.2,8.64 | v59.18,44.45 64.64,49.91 U$5.9VOUT- | 57.4,14.73 54.1,14.73 52.58,13.21 49.02,13.21 | POWER.2 35.58,27.18 41.91,27.18 44.01,29.28 CURRENT2.4 | U$9.GND 6.66,3.76 6.66,6.15 7.49,6.99 15.24,6.99 16.07,6.16 16.64,5.59 27.69,5.59 28.45,6.35 30.73,6.35 33.53,9.14 34.54,9.14 35.69,10.29 38.1,12.7 43.43,12.7 44.45,11.68 47.5,11.68 | 72.01,5.84 v65.28,5.84 | IMD.P$3 IMD.P$2 50.42,7.24 48.13,9.53 47.5,10.16 47.5,11.68 | EM.P$2 46.48,14.73 48.01,13.21 49.02,13.21 | IMD.P$4 57.4,12.95 57.4,14.73 | 47.5,11.68 49.02,13.21 | U$12.COIL- 140.72,3.05 74.81,3.05 72.01,5.84
HV+FUSED
  Bottom 1.016: HV+FUSED.1 HV+FUSED.2 IMD_HV+.2 | IMD_HV+.1 IMD_HV+.2 | U$3.P$1 141.22,28.53 FUSE.L2 FUSE.L1 150.21,33.62 154.5,37.91 168.29,37.91 IMD_HV+.2 | C1.P$1 175.26,30.94 IMD_HV+.2
HV+FUSED_1A  (via drill 0.6)
  Top 0.61: v118.87,61.98 v118.87,30.23 v118.87,16.51
  Bottom 0.61: v118.87,61.98 111.25,61.98 108.2,58.93 HV_REG1.1 | HV_REG2.1 101.85,30.23 v118.87,30.23 120.9,28.19 127.16,28.19 FUSE.R2 | U$5.1VIN+ 117.09,14.73 v118.87,16.51 | FUSE.R2 FUSE.R1 | R14.2 130.21,39.83 FUSE.R2
HV-FUSED
  Bottom 1.016: HV-FUSED.2 HV-FUSED.1 | FUSE1.L2 FUSE1.L1 164.38,56.39 HV-FUSED.2 | HV-FUSED.2 IMD_HV-.2 IMD_HV-.1 175.26,51.56 185.88,40.94 C1.P$2 192.32,40.94 197.36,45.97 U$4.P$1
HV-FUSED_1A  (via drill 0.6)
  Top 0.61: v123.7,24.13 v123.7,33.02
  Bottom 0.61: 113.28,50.29 U$5.4VIN- R8.2 | 113.28,50.29 118.36,50.29 121.16,47.5 THRESHOLD.3 127.76,37.08 v123.7,33.02 | FUSE1.R2 FUSE1.R1 150.07,51.43 INDICATOR.2 | v123.7,24.13 120.14,24.13 116.33,20.07 107.58,20.07 R20.2 | 113.28,50.29 124.59,61.59 124.59,61.72 138.43,61.72 140.11,60.04 FUSE1.R2 | R19.1 140.11,51.61 FUSE1.R2
ISOSPI-M
  Top 0.254: U$2.3 14.48,43.31 14.37,43.42 R40.1 12.21,43.43 ISOSPI.P$2
ISOSPI-P
  Top 0.254: U$2.2 15.75,43.04 R40.2 16.14,44.82 13.74,47.22 ISOSPI.P$1
MISO  (via drill 0.45)
  Top 0.254: R37.2 36.83,7.62 36.45,8 24.64,8 23.75,8.89 22.61,8.89 v22.1,8.38
  Top 0.406: R37.2 36.83,6.6 U$9.D12
  Bottom 0.254: v22.1,8.38 21.71,8.77 U$8.3
MOSI  (via drill 0.4)
  Top 0.254: v23.24,8.13 24,7.37 34.66,7.37 R36.2
  Top 0.406: R36.2 34.8,6.1 U$9.D11
  Bottom 0.254: v23.24,8.13 23.24,9.27 22.23,10.29 22.23,10.35 22.22,10.35 22.22,10.91 U$8.2
N$1
  Bottom 0.61: R25.2 87.49,25.53 HV_REG2.2(TAB) 92.53,30.3 95.96,33.73 AI_SSR.4
N$2
  Bottom 0.61: 94.94,57.91 HV_REG1.2(TAB) 89.52,56.64 | 89.52,56.64 R13.2 | 89.52,56.64 88.25,57.91 TSAL_SSR.1
N$3
  Top 0.61: ON-LED.C R5.1
N$4
  Top 0.406: R39.2 17.92,15.86 19.43,14.35 25.02,14.35 26.04,15.37 U$1.2
N$5
  Bottom 0.61: R26.1 88.9,39.67 AI_SSR.2
N$6
  Bottom 0.61: AI_SSR.1 83.01,36.07 TSAL_SSR.2
N$7  (via drill 0.6)
  Top 0.61: v122.94,38.86 127.25,38.86 131.32,42.93 144.32,42.93 INDICATOR.1
  Bottom 0.61: AI_SSR.3 104.14,38.61 108.2,34.54 118.62,34.54 v122.94,38.86
N$8
  Bottom 0.61: R9.1 R8.1
N$9  (via drill 0.6)
  Top 0.61: v122.94,43.18 v122.94,53.59
  Bottom 0.61: R26.2 88.9,43.18 106.43,43.18 108.71,45.47 115.57,45.47 117.86,43.18 v122.94,43.18 | v122.94,53.59 129.24,53.59 THRESHOLD.2(TAB)
N$10
  Bottom 0.61: R14.1 R15.1
N$11
  Bottom 0.61: R15.2 R16.2
N$12
  Bottom 0.61: R18.1 R17.1
N$13
  Bottom 0.61: R19.2 R18.2
N$14
  Bottom 0.61: R10.2 R9.2
N$15
  Bottom 0.61: R23.1 R22.1 98.92,18.15 99.44,18.67 HV_REG2.3 99.31,23.24
N$16
  Bottom 0.61: R11.2 R12.2
N$17
  Bottom 0.61: R13.1 R12.1
N$18
  Bottom 0.61: 100.84,50.29 HV_REG1.3 | R10.1 100.84,50.29 | 100.84,50.29 100.84,47.75 R11.1
N$19
  Bottom 0.61: R24.2 R23.2
N$20
  Bottom 0.61: R24.1 R25.1
N$21
  Bottom 0.61: R21.2 R22.2
N$22
  Bottom 0.61: THRESHOLD.1 132.33,42.03 R17.2 138.94,40.25 R16.1
N$23
  Bottom 0.61: R20.1 R21.1
N$25  (via drill 0.4)
  Top 0.406: U$7.1 7.24,5.71 7.62,5.33 v10.67,5.33
  Bottom 0.406: v10.67,5.33 15.24,5.33 U$9.D3(CANTX)
N$26
  Top 0.406: R30.2 7.99,14.59 7.24,13.84 U$7.8
N$27
  Top 0.406: R28.1 C8.2
N$28
  Top 0.406: R29.1 C9.2
N$29
  Top 0.406: LED.C 46.1,3.78 R31.1
N$30  (via drill 0.45)
  Top 0.406: v32.77,21.59 32.13,20.95 31.37,20.95 30.99,20.57 30.99,16.52 R1.2
  Bottom 0.406: CURRENT2.2 37.41,29.28 36.58,28.45 35.56,28.45 34.29,27.18 32.51,27.18 31.5,26.16 31.5,23.88 32.77,22.61 v32.77,21.59
N$31
  Bottom 0.254: R33.1 23.36,14.48 U$8.16
N$32
  Bottom 0.254: 26.17,15.49 23.75,15.49 23.24,16 22.51,16 22.42,15.9 22.22,15.71 22.22,15.15 U$8.15
  Bottom 0.406: R33.2 R34.1 26.17,15.49
N$33  (via drill 0.4)
  Top 0.254: v18.29,20.32 17.27,21.34 15.75,21.34 14.6,22.49 14.6,22.88 R35.1 14.48,22.98 U$2.22
  Bottom 0.254: v18.29,20.32 18.29,17.53 19.71,16.11 U$8.10
N$34  (via drill 0.4)
  Top 0.254: v20.83,20.32 18.29,22.86 R35.2 15.75,23.51 U$2.23
  Bottom 0.254: U$8.11 20.21,16.14 20.83,16.76 v20.83,20.32
N$35
  Top 0.254: U$2.24 18.79,24.01 C4.1
N$36
  Top 0.406: U$9.D4(CANRX) 17.53,5.59 12.51,5.59 U$7.4
N$37  (via drill 0.5)
  Top 0.406: LED.A 42.2,3.17 v41.91,3.46
  Bottom 0.406: U$9.D7(RX3) 27.18,3.81 28.96,5.59 32,5.59 32.26,5.33 40.39,5.33 41.91,3.81 v41.91,3.46
N$38
  Top 0.406: 35.74,13.46 34.01,11.74 34.01,10.06 U$11.1 | U$10.WDO 35.74,13.46 | R38.2 36.2,13.92 35.74,13.46
N$40
  Top 0.406: U$9.A8 17.02,15.24 17.14,15.11 17.53,15.11 18.92,13.72 25.78,13.72 25.91,13.84 27.69,13.84 28.32,13.21 28.32,10.37 U$11.4
N$42  (via drill 0.4)
  Top 0.406: IMD-OK.A 58.29,31.37 v59.18,32.26
  Bottom 0.254: IC2.2 IC2.1
  Bottom 0.406: IC2.1 60.6,30.99 59.33,32.26 v59.18,32.26
N$43  (via drill 0.5)
  Top 0.406: v53.85,29.72 54.2,29.72 BMS-OK.A
  Bottom 0.406: IC2.7 v53.85,29.72
  Bottom 0.61: IC2.6 IC2.7
N$44
  Top 0.61: R4.1 BMS-OK.C
N$45
  Top 0.61: IMD-OK.C R3.2
N$50
  Top 0.406: U$9.A0 39.24,16.89 39.88,16.89 U$10.WDI
N$53  (via drill 0.4, 0.45)
  Top 0.406: v33.53,6.35 21.59,6.35 19.3,8.64 17.53,8.64 v16.89,9.27 | CURRENT1.3 42.16,39.51 42.16,28.45 40.64,26.92 38.61,26.92 38.35,26.67 38.35,23.62 38.86,23.11 v47.24,23.11 | v37.59,10.67 39.62,12.7 42.29,12.7 43.43,13.84 43.43,19.18 v43.37,19.24 | v10.41,15.49 11.06,14.85 R44.2
  Bottom 0.406: v47.24,23.11 v43.37,19.24 | v33.53,6.35 33.53,6.6 v37.59,10.67 | v10.41,15.49 10.67,15.49 v16.89,9.27
N$54  (via drill 0.4)
  Top 0.406: R2.2 33.52,17.29 v33.52,20.32
  Bottom 0.406: CURRENT2.3 45.42,24.59 42.16,21.34 34.54,21.34 v33.53,20.32 v33.52,20.32
OKHS  (via drill 0.4, 0.5, 0.55)
  Top 0.406: 63.78,28.47 v63.75,28.45
  Top 0.61: v65.79,21.59 64.83,21.59 62.77,23.65 62.77,27.46 63.78,28.47 | v63.75,28.45 62.74,29.46 62.74,44.2 v62.99,44.45
  Bottom 0.406: IC2.3 v63.75,28.45
  Bottom 0.61: v62.99,44.45 61.72,43.18 51.82,43.18 51.05,43.94 37.34,43.94 36.07,45.21 36.07,46.74 35.05,47.75 32,47.75 30.23,49.53 30.23,56.01 MAIN.7 | v65.79,21.59 68.07,19.3 68.07,12.95 66.8,11.68 65.53,11.68 61.09,7.24 IMD.P$5
SCK
  Bottom 0.254: U$8.4 21.21,8
  Bottom 0.406: U$9.D13 39.88,17.78 38.61,16.51 33.78,16.51 31.5,14.22 31.5,10.29 29.46,8.26 27.69,8.26 26.75,7.32 21.89,7.32 21.21,8
SHUTDOWN6
  Bottom 1.016: INTERLOCK.1 48.94,53.77 51.18,56.01 51.18,60.71 50.16,61.72 36.95,61.72 MAIN.1
SHUTDOWN7  (via drill 0.55)
  Top 0.61: v63.5,7.62 61.47,9.65 61.47,45.47 58.42,48.51 D1.A
  Top 1.016: INTERLOCK.2 57.4,50.25 D1.A
  Bottom 0.61: D2.C 64.89,7.62 v63.5,7.62 63.5,5.08 66.55,2.03 165.1,2.03 U$12.COIL+
  Bottom 1.016: INTERLOCK.2 RELAYS.2 RELAYS.1
SHUTDOWN7_EXT_OUT
  Top 1.016: D1.C 44.96,50.8 44.96,56.39 38.1,56.39 35.76,54.05 MAIN.2
TEMP_SENSE_1
  Top 0.406: R44.1 R7.2 13.97,18.29 U$9.A9
TEMP_SENSE_2
  Top 0.406: R2.1 32.64,16.37 R43.2 32.64,18.41 U$9.A2
TRIM
  Bottom 0.406: TRIM-.1 U$5.7TRIM 64.64,30.36 TRIM+.1
TSAL+
  Bottom 0.61: TSAL_SSR.3 60.71,55.37 57.15,51.82 36.58,51.82 34.61,49.85 MAIN.3
TSAL_1  (via drill 0.55)
  Top 0.61: v66.04,44.7 64.52,46.23 63.25,46.23 61.72,47.75 61.72,55.37 v64.26,57.91
  Bottom 0.406: U$5.5VOUT+ U$5.6SENSE+ 64.64,27.04 TRIM+.2
  Bottom 0.61: U$5.6SENSE+ 65.79,24.89 68.33,27.43 68.33,42.42 v66.04,44.7 | v64.26,57.91 TSAL_SSR.4

### Text on the board
bTest: DANGER HIGH VOLTAGE | DANGER HIGH VOLTAGE
tDocu: hv_board_rev2 | TS | GLV | DANGER / HIGH / VOLTAGE | isoSPI | isoSPI | DANGER HIGH VOLTAGE | FH JUMP | - | isoSPI | Grounded Low Voltage PCB Area | TRACTIVE SYSTEM / PCB AREA | FH JUMP | + | GLV | TS | TS | GLV | TS | TS | GLV | TS | GLV | GLV | GLV | TS
bDocu: isoSPI | isoSPI | GLV | TS | DANGER HIGH VOLTAGE | isoSPI | Grounded Low Voltage PCB Area | TRACTIVE SYSTEM / PCB AREA | isoSPI | isoSPI | GLV | TS | TS | GLV | TS | GLV | TS | TS | GLV | TS | GLV | GLV